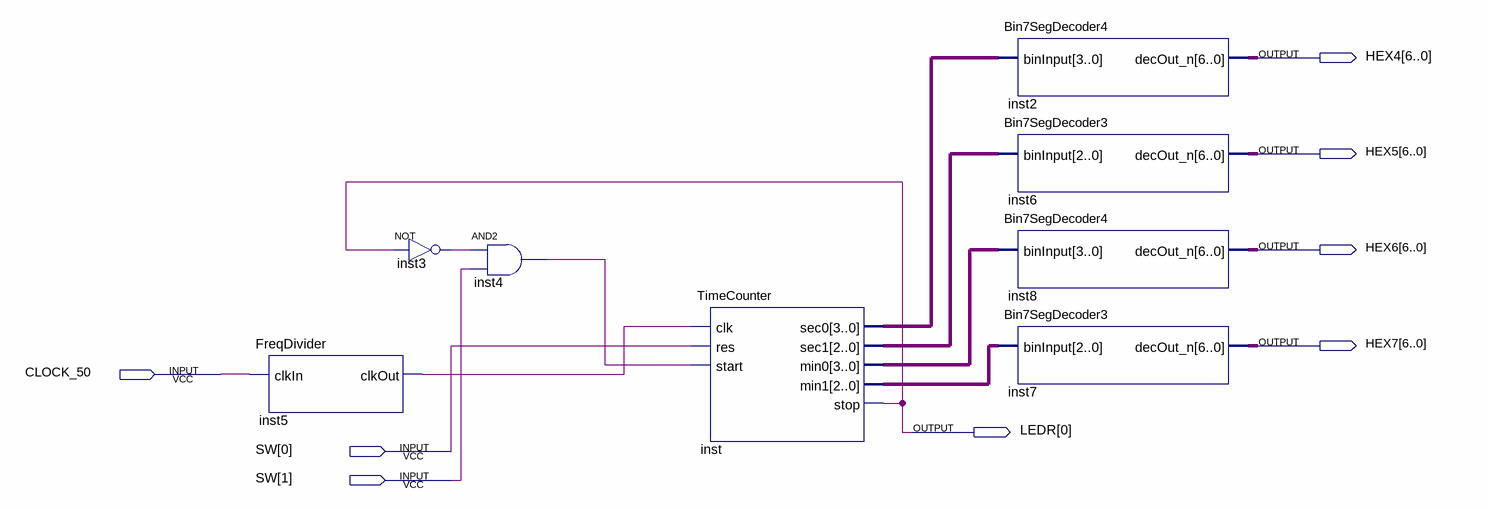
[diagram p0: schematic sheet]
// Quartus schematic Fase2.bdf as structural Verilog: 8 symbols, 8 pins
module Fase2 (
  input  CLOCK_50,
  input  [1:0] SW,
  output [6:0] HEX4,
  output [6:0] HEX5,
  output [6:0] HEX6,
  output [6:0] HEX7,
  output [0:0] LEDR
);

  wire inst3_out, inst4_out, inst5_clkout;
  wire [2:0] inst_min1, inst_sec1;
  wire [3:0] inst_min0, inst_sec0;

  FreqDivider inst5 (.clkIn(CLOCK_50), .clkOut(inst5_clkout));
  not inst3 (inst3_out, LEDR[0]);
  and inst4 (inst4_out, inst3_out, SW[1]);
  TimeCounter inst (
    .clk(inst5_clkout), .res(SW[0]), .start(inst4_out), .sec0(inst_sec0), .sec1(inst_sec1), .min0(inst_min0),
    .min1(inst_min1), .stop(LEDR[0]));
  Bin7SegDecoder4 inst2 (.binInput(inst_sec0), .decOut_n(HEX4));
  Bin7SegDecoder3 inst6 (.binInput(inst_sec1), .decOut_n(HEX5));
  Bin7SegDecoder4 inst8 (.binInput(inst_min0), .decOut_n(HEX6));
  Bin7SegDecoder3 inst7 (.binInput(inst_min1), .decOut_n(HEX7));
endmodule
